# EAGLE design PDAmpV2 (EAGLE 6.4)
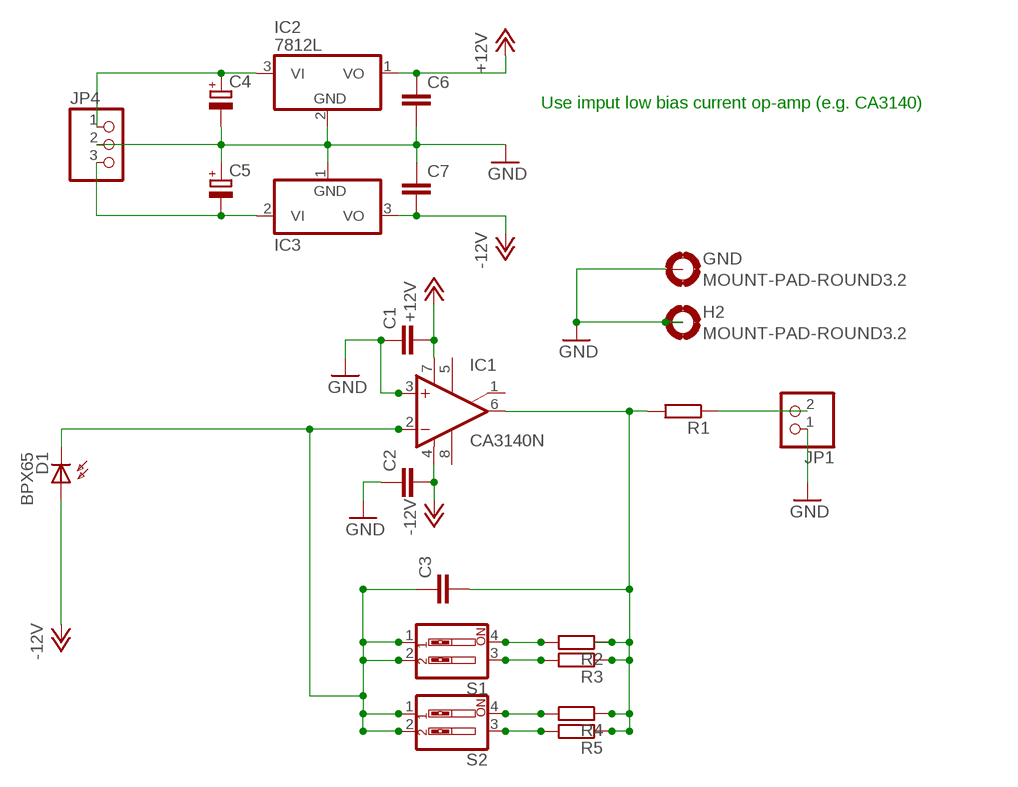
[diagram p0: schematic, sheet 1]

## Parts
C1  C-EU025-025X050  [C025-025X050]
C2  C-EU025-025X050  [C025-025X050]
C3  C-EU050-030X075  [C050-030X075]
C4  CPOL-EUE5-8.5  [E5-8,5]
C5  CPOL-EUE5-8.5  [E5-8,5]
C6  C-EU050-030X075  [C050-030X075]
C7  C-EU050-030X075  [C050-030X075]
D1  BPX65  [BPX65]
GND  MOUNT-PAD-ROUND3.2  [3,2-PAD]
H2  MOUNT-PAD-ROUND3.2  [3,2-PAD]
IC1  CA3140N  [DIL08]
IC2  7812L  [TO92]
IC3  7912L  [TO92]
JP1  PINHD-1X2  [1X02]
JP4  PINHD-1X3  [1X03]
R1  R-EU_0207/10  [0207/10]
R2  R-EU_0207/10  [0207/10]
R3  R-EU_0207/10  [0207/10]
R4  R-EU_0207/10  [0207/10]
R5  R-EU_0207/10  [0207/10]
S1  SW_DIP-2  [EDG-02]
S2  SW_DIP-2  [EDG-02]

## Nets
+12V: C1.2 C6.1 IC1.7(V+) IC2.1(VO)
-12V: C2.2 C7.2 D1.A IC1.4(V-) IC3.3(VO)
GND: C1.1 C2.1 C4.- C5.+ C6.2 C7.1 GND.B3,2(MOUNT) H2.B3,2(MOUNT) IC1.3(+IN) IC2.2(GND) IC3.1(GND) JP1.1 JP4.2
N$4: C3.1 D1.K(C) IC1.2(-IN) S1.1 S1.2 S2.1 S2.2
N$7: C4.+ IC2.3(VI) JP4.1
N$9: C5.- IC3.2(VI) JP4.3
N$10: JP1.2 R1.1
N$12: R2.2 S1.4
N$13: R3.2 S1.3
N$14: R4.2 S2.4
N$15: R5.2 S2.3
N$16: C3.2 IC1.6(OUT) R1.2 R2.1 R3.1 R4.1 R5.1
Unconnected: IC1.1(ON/CMP) IC1.5(ON) IC1.8(CMP)

## Notes on the sheet
- Use imput low bias current op-amp (e.g. CA3140)

## Library data of the parts
C1-C3 C6 C7 = rcl:C-EU: CAPACITOR, European symbol
C4 C5 = rcl:CPOL-EU: POLARIZED CAPACITOR, European symbol
D1 = opto-trans-siemens:BPX65: PHOTO DIODE; MPN: BPX65.; OC_FARNELL: 327451; OC_NEWARK: 06WX2764
GND H2 = holes:MOUNT-PAD-ROUND: MOUNTING PAD, round
IC1 = linear:CA3140: OP AMP
IC2 = linear:78*: Positive VOLTAGE REGULATOR Source: http://cache.national.com/ds/LM/LM78L05.pdf http://www.fairchildsemi.com/ds/LM/LM7805.pdf
IC3 = linear:79*: Negative VOLTAGE REGULATOR
JP1 = pinhead:PINHD-1X2: PIN HEADER
JP4 = pinhead:PINHD-1X3: PIN HEADER
R1-R5 = resistor:R-EU_: RESISTOR, European symbol
S1 S2 = special:SW_DIP-2: DIP SWITCH

## Board
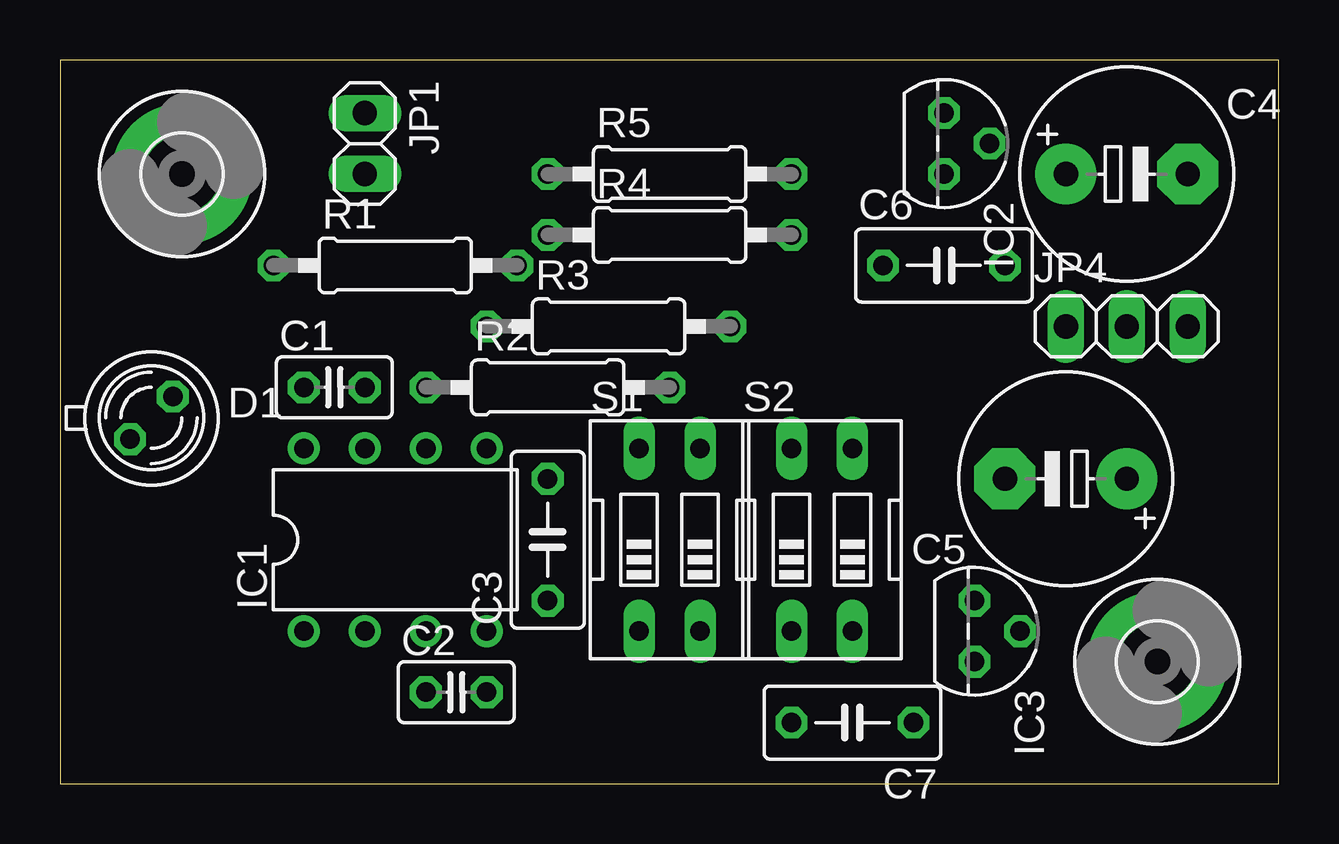
[diagram p1: board, top side]
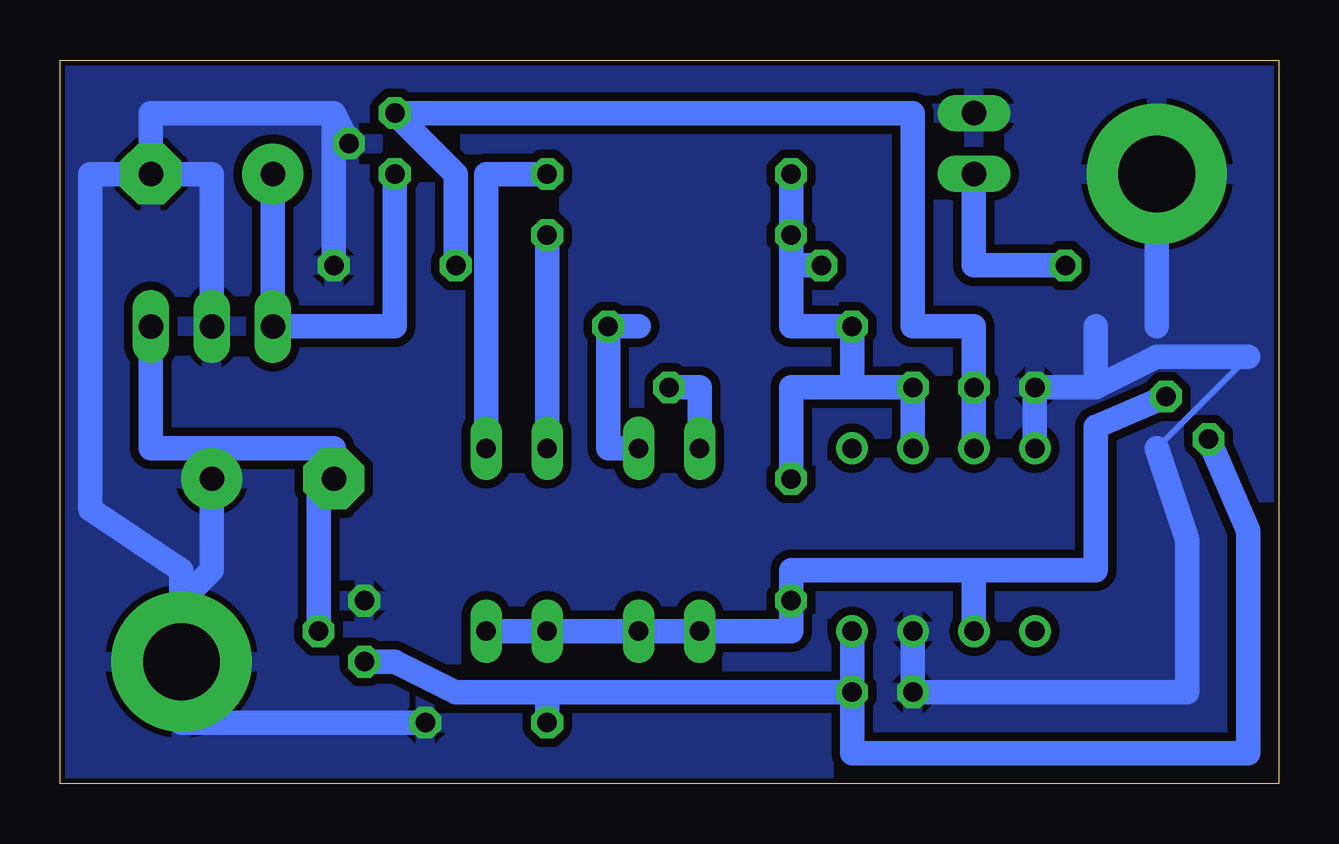
[diagram p2: board, bottom side, seen from below]

Size 50.78 x 30.15 mm. Coordinates in mm from the lower left corner, seen from the top.
Outline: 0,0 50.78,0 50.78,30.15 0,30.15 0,0
Copper layers (1*16): Top 0.035mm / dielectric 1.5mm / Bottom 0.035mm
Design rules "default *": minimum track width 10mil, minimum drill 24mil, track to track 14mil, track to pad 14mil, pad to pad 8mil, via to via 8mil, smd to smd 8mil, copper to edge 8mil, drill to drill 8mil, minimum pad ring 10mil, minimum via ring 8mil, stop-mask expansion 4mil, vias tented up to drill 0mil, thermal gap 10mil

### Footprints (pad centres in the part's own frame; a part is rotated, then mirrored left to right if it is on the bottom)
C025-025X050 = drill 0.813 octagon: 1 -1.27,0; 2 1.27,0
C050-030X075 = drill 0.813 octagon: 1 -2.54,0; 2 2.54,0
E5-8,5 = drill 1.016 pad 2.54: + -2.54,0 | drill 1.016 pad 2.54 octagon: - 2.54,0
BPX65 = drill 0.813 octagon: A -0.889,-0.889; K 0.889,0.889
3,2-PAD = drill 3.2 pad 5.842: B3,2 0,0
DIL08 = drill 0.813 pad 1.27: 1 -3.81,-3.81; 2 -1.27,-3.81; 3 1.27,-3.81; 4 3.81,-3.81; 5 3.81,3.81; 6 1.27,3.81; 7 -1.27,3.81; 8 -3.81,3.81
TO92 = drill 0.813 octagon: 1 -1.27,0; 2 0,1.905; 3 1.27,0
1X02 = drill 1.016 long: 1 -1.27,0; 2 1.27,0
1X03 = drill 1.016 long: 1 -2.54,0; 2 0,0; 3 2.54,0
0207/10 = drill 0.813 octagon: 1 -5.08,0; 2 5.08,0
EDG-02 = drill 0.813 long: 1 -1.27,-3.81; 2 1.27,-3.81; 3 1.27,3.81; 4 -1.27,3.81

### Placement (x,y rotation side)
C1  11.43,16.51 0 top
C2  16.51,3.81 0 top
C3  20.32,10.16 90 top
C4  44.45,25.4 0 top
C5  41.91,12.7 180 top
C6  36.83,21.59 0 top
C7  33.02,2.54 180 top
D1  3.81,15.24 0 top
GND  5.08,25.4 0 top
H2  45.72,5.08 0 top
IC1  13.97,10.16 0 top
IC2  36.83,26.67 270 top
IC3  38.1,6.35 270 top
JP1  12.7,26.67 270 top
JP4  44.45,19.05 0 top
R1  13.97,21.59 0 top
R2  20.32,16.51 0 top
R3  22.86,19.05 0 top
R4  25.4,22.86 0 top
R5  25.4,25.4 0 top
S1  25.4,10.16 0 top
S2  31.75,10.16 0 top

### Tracks (layer width: path | path; a pad name or v marks a point on that pad's centre or on a via)
+12V
  Bottom 1.016: IC1.7 C1.2 12.7,19.05 15.24,19.05 15.24,27.94 IC2.1 34.29,25.4 C6.1
-12V
  Bottom 1.016: IC1.4 C2.2 | C2.2 17.78,1.27 1.27,1.27 1.27,10.54 D1.A | C2.2 30.48,3.81 | C7.2 30.48,3.81 | 30.48,3.81 34.29,3.81 36.83,5.08 IC3.3
GND
  Bottom 0.254: 1.27,17.78 5.08,13.97
  Bottom 1.016: IC2.2 39.37,27.94 | C6.2 39.37,27.94 | 39.37,27.94 46.99,27.94 C4.- | C4.- 44.45,25.4 JP4.2 | H2.B3,2 45.72,8.89 49.53,11.43 49.53,25.4 C4.- | H2.B3,2 45.72,2.54 C7.1 | C5.+ 44.45,8.89 45.72,7.62 H2.B3,2 | 10.16,13.97 C1.1 7.62,16.51 | 7.62,16.51 7.62,19.05 | 5.08,19.05 GND.B3,2 | IC1.3 C2.1 3.81,3.81 3.81,10.16 5.08,13.97 | 7.62,16.51 5.08,17.78 1.27,17.78
  pour Bottom: 50.8,30.48 50.8,0 0,0 0,30.48
N$4
  Bottom 1.016: S2.2 S2.1 S1.2 S1.1 20.32,6.35 C3.1 20.32,8.89 12.7,8.89 | D1.K 7.62,14.86 7.62,8.89 12.7,8.89 | IC1.2 12.7,8.89
N$7
  Bottom 1.016: C4.+ JP4.1 36.83,19.05 IC2.3
N$9
  Bottom 1.016: JP4.3 46.99,13.97 39.37,13.97 C5.- 40.01,12.06 IC3.2
N$10
  Bottom 1.016: JP1.2 12.7,21.59 R1.1
N$12
  Bottom 1.016: S1.4 24.13,16.51 R2.2
N$13
  Bottom 1.016: S1.3 27.94,13.97 R3.2 26.67,19.05
N$14
  Bottom 1.016: R4.2 S2.4
N$15
  Bottom 1.016: S2.3 33.02,25.4 R5.2
N$16
  Bottom 1.016: IC1.6 R2.1 17.78,16.51 | R5.1 R4.1 20.32,21.59 | 17.78,16.51 20.32,16.51 C3.2 | 20.32,21.59 20.32,19.05 R3.1 17.78,16.51 | R1.2 20.32,21.59